# Altium schematic sheet OZ440-SE110-CAR001-SCH1.SchDoc: Carte IMU GPS
size A3; Date: 08/04/14; CheckedBy: GS; Author: BM; DocumentNumber: OZ440-SE110-CAR001-SCH01; Revision: A; SheetNumber: 1; SheetTotal: 1
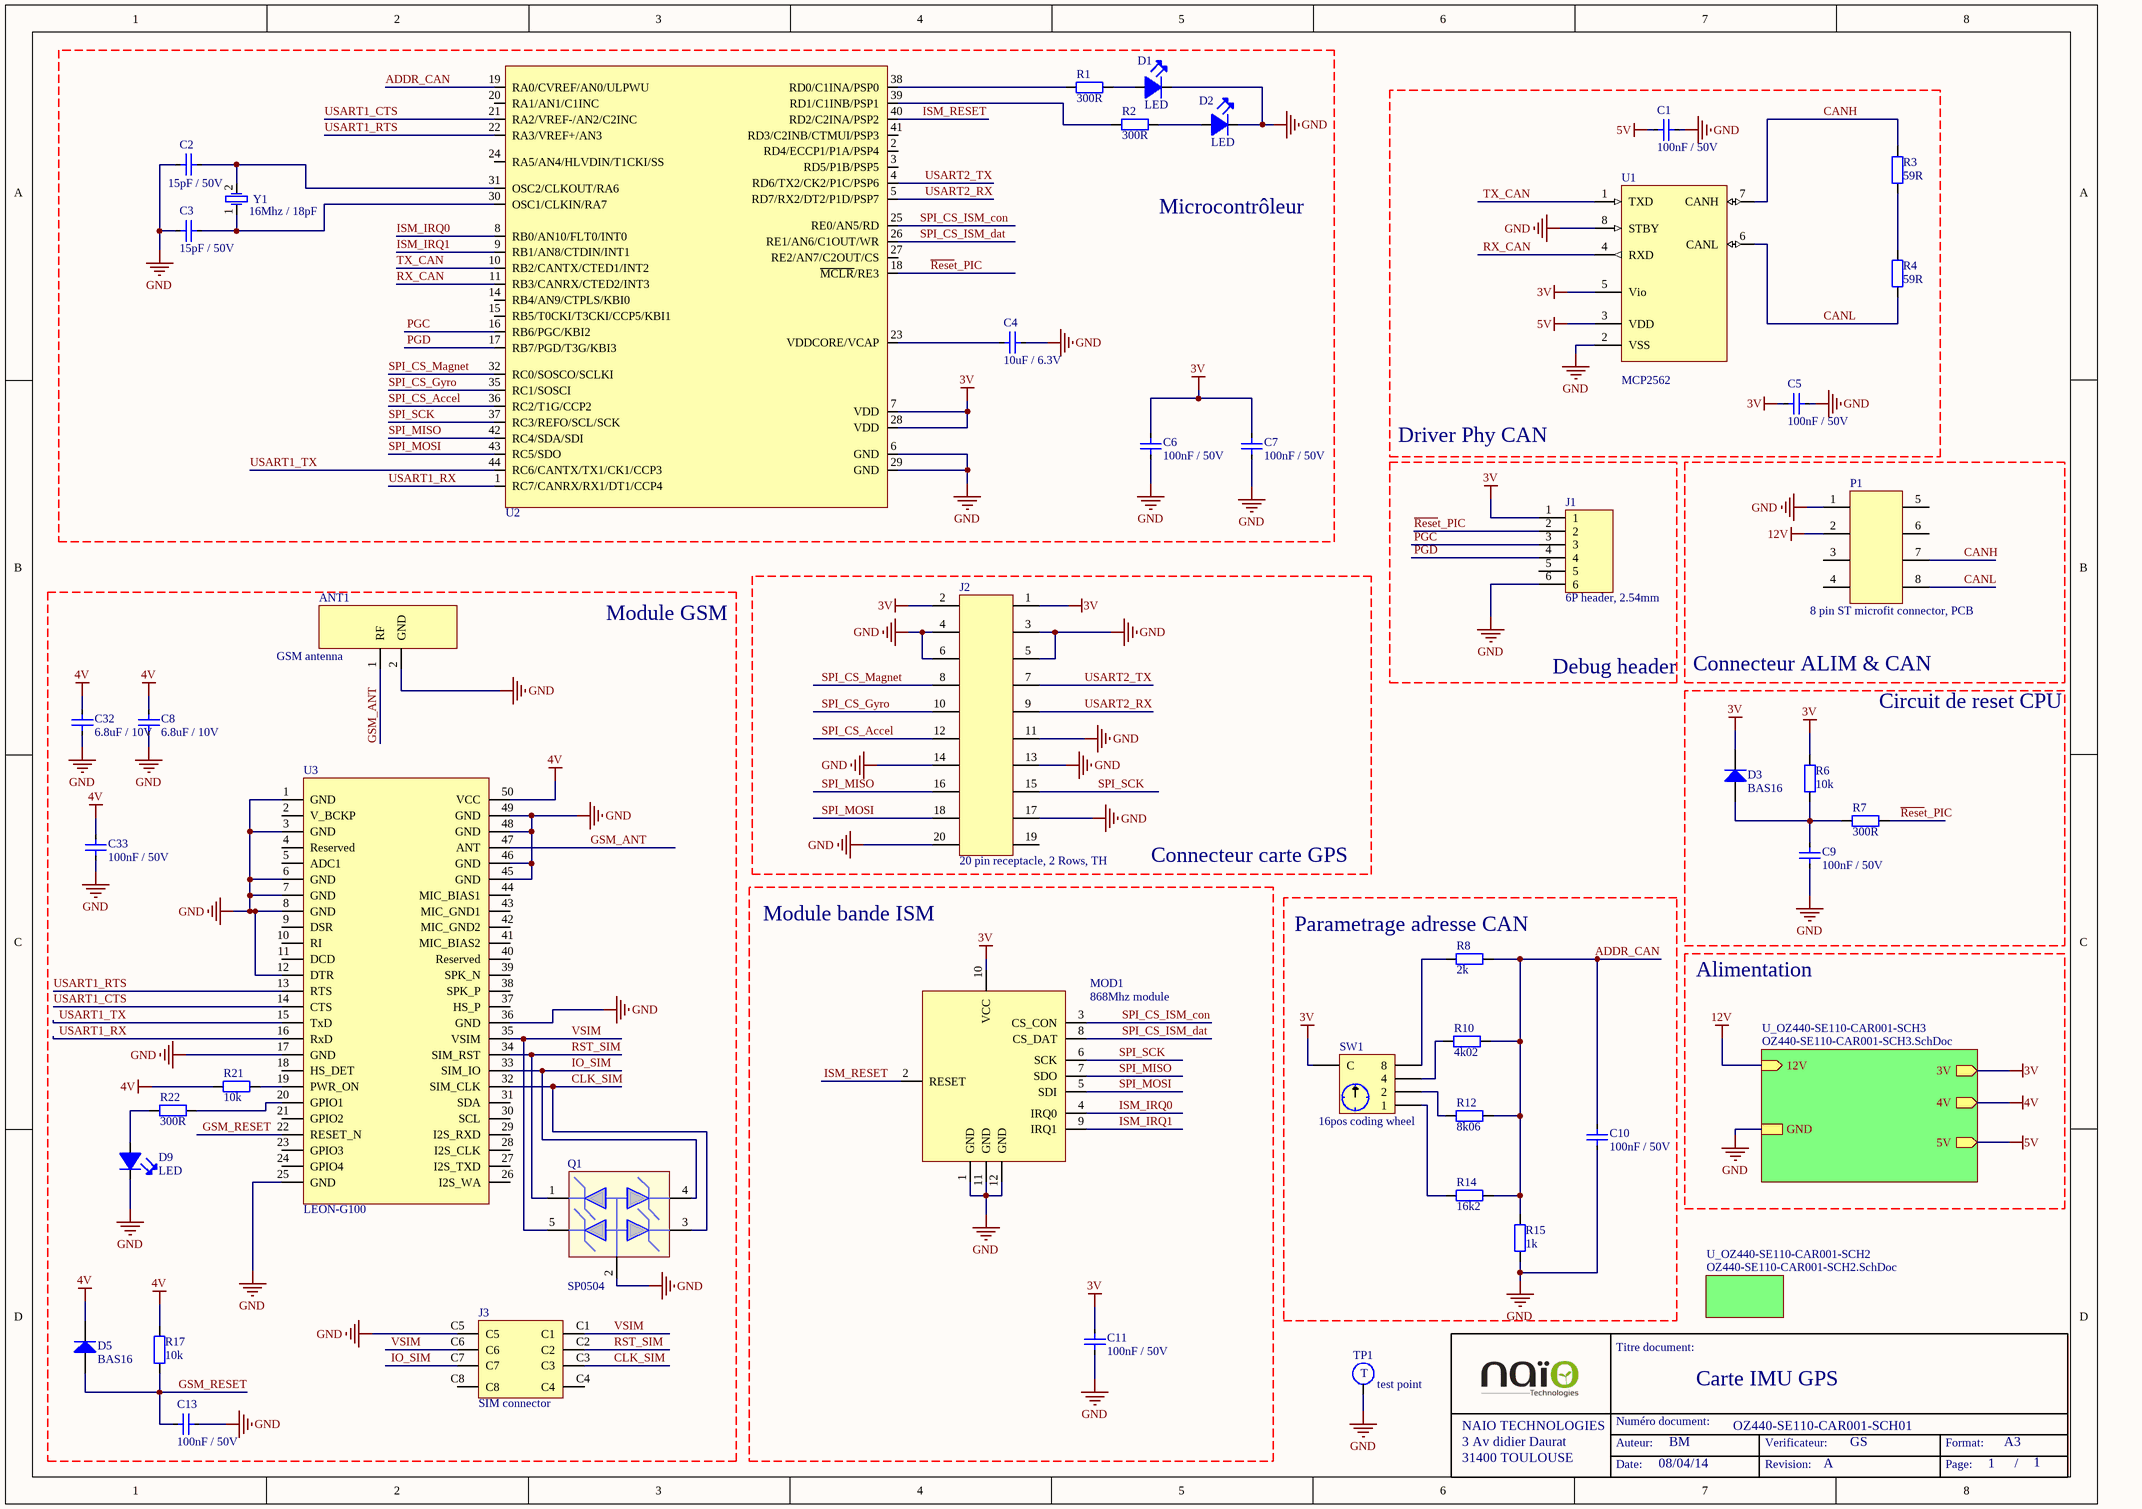
[diagram p0: OZ440-SE110-CAR001-SCH1.SchDoc]

## Parts
ANT1  Displayed reference: GSM antenna  [ANT_SMD-SPE-PA.22]  (hidden comment: ANT-STD-GSM)
C1  Displayed reference: 100nF / 50V  [C0805-STD]  (hidden comment: CAP-SMD)
C2  Displayed reference: 15pF / 50V  [C0805-STD]  (hidden comment: CAP-SMD)
C3  Displayed reference: 15pF / 50V  [C0805-STD]  (hidden comment: CAP-SMD)
C4  Displayed reference: 10uF / 6.3V  [C0805-STD]  (hidden comment: CAP-SMD)
C5  Displayed reference: 100nF / 50V  [C0805-STD]  (hidden comment: CAP-SMD)
C6  Displayed reference: 100nF / 50V  [C0805-STD]  (hidden comment: CAP-SMD)
C7  Displayed reference: 100nF / 50V  [C0805-STD]  (hidden comment: CAP-SMD)
C8  Displayed reference: 6.8uF / 10V  [C0805-STD]  (hidden comment: CAP-SMD)
C9  Displayed reference: 100nF / 50V  [C0805-STD]  (hidden comment: CAP-SMD)
C10  Displayed reference: 100nF / 50V  [C0805-STD]  (hidden comment: CAP-SMD)
C11  Displayed reference: 100nF / 50V  [C0805-STD]  (hidden comment: CAP-SMD)
C13  Displayed reference: 100nF / 50V  [C0805-STD]  (hidden comment: CAP-SMD)
C32  Displayed reference: 6.8uF / 10V  [C0805-STD]  (hidden comment: CAP-SMD)
C33  Displayed reference: 100nF / 50V  [C0805-STD]  (hidden comment: CAP-SMD)
D1  LED  [0603-SPE-LED]
D2  LED  [0603-SPE-LED]
D3  Displayed reference: BAS16  [SOT23-STD]  (hidden comment: BAS16-SOT23)
D5  Displayed reference: BAS16  [SOT23-STD]  (hidden comment: BAS16-SOT23)
D9  LED  [0603-SPE-LED]
J1  Displayed reference: 6P header, 2.54mm  [6P_HEADER-STD_TH_1ROW]  (hidden comment: CONN-STD-6P_1ROW)
J2  Displayed reference: 20 pin receptacle, 2 Rows, TH  [CONN-SPE_ESQ-110-12-G-D]  (hidden comment: CONN-STD-20P_2ROW)
J3  Displayed reference: SIM connector  [CONN-SPE-91228-3001_SIM_MOLEX]  (hidden comment: CONN-SPE_91228-3001_carte_SIM)
MOD1  Displayed reference: 868Mhz module  [MOD-SPE-MRF89]  (hidden comment: MRF89X-SMD12)
P1  Displayed reference: 8 pin ST microfit connector, PCB  [CONN-SPE_MOLEX_43045-0812]  (hidden comment: CONN-SPE-8P_MOLEX_43045-0801)
Q1  Displayed reference: SP0504  [SC70-SPE-SP0504]  (hidden comment: SP0504-SC70)
R1  Displayed reference: 300R  [R0805-STD]  (hidden comment: RES-SMD)
R2  Displayed reference: 300R  [R0805-STD]  (hidden comment: RES-SMD)
R3  Displayed reference: 59R  [R0805-STD]  (hidden comment: RES-SMD)
R4  Displayed reference: 59R  [R0805-STD]  (hidden comment: RES-SMD)
R6  Displayed reference: 10k  [R0805-STD]  (hidden comment: RES-SMD)
R7  Displayed reference: 300R  [R0805-STD]  (hidden comment: RES-SMD)
R8  Displayed reference: 2k  [R0805-STD]  (hidden comment: RES-SMD)
R10  Displayed reference: 4k02  [R0805-STD]  (hidden comment: RES-SMD)
R12  Displayed reference: 8k06  [R0805-STD]  (hidden comment: RES-SMD)
R14  Displayed reference: 16k2  [R0805-STD]  (hidden comment: RES-SMD)
R15  Displayed reference: 1k  [R0805-STD]  (hidden comment: RES-SMD)
R17  Displayed reference: 10k  [R0805-STD]  (hidden comment: RES-SMD)
R21  Displayed reference: 10k  [R0805-STD]  (hidden comment: RES-SMD)
R22  Displayed reference: 300R  [R0805-STD]  (hidden comment: RES-SMD)
SW1  Displayed reference: 16pos coding wheel  [SW-SPE-CTS_220-AMA16]  (hidden comment: Switch-STD-coding_wheel)
TP1  Displayed reference: test point  [MEC-STD-TEST_POINT_DIAM1.4]  (hidden comment: TP-STD-TEST_POINT)
U1  Displayed reference: MCP2562  [SO8-SPE-MCP2561]  (hidden comment: MCP2562-SOIC08)
U2  P18F45K80-TQFP44  [TQFP44-SPE-PIC18F45k80]  (value not drawn)
U3  Displayed reference: LEON-G100  [SMD50_SPE_LEON-Gx]  (hidden comment: LEON-Gx-SPE-SMD)
Y1  Displayed reference: 16Mhz / 18pF  [XTAL-SPE-HC49_SMD]  (hidden comment: XTAL-SMD)

## Sub-sheets
U_OZ440-SE110-CAR001-SCH2 = OZ440-SE110-CAR001-SCH2.SchDoc: no entries
U_OZ440-SE110-CAR001-SCH3 = OZ440-SE110-CAR001-SCH3.SchDoc: 12V (in), 4V (out), 3V (out), 5V (out), GND

## Nets
3V: C5.2 C6.2 C7.2 C11.2 D3.3(K) J1.1 J2.1 J2.2 MOD1.10(VCC) R6.2 SW1.C U1.5(Vio) U2.7(VDD) U2.28(VDD) ; sheet U_OZ440-SE110-CAR001-SCH3/3V
4V: C8.2 C32.2 C33.1 D5.3(K) R17.2 R21.2 U3.50(VCC) ; sheet U_OZ440-SE110-CAR001-SCH3/4V
5V: C1.2 U1.3(VDD) ; sheet U_OZ440-SE110-CAR001-SCH3/5V
12V: P1.2 ; sheet U_OZ440-SE110-CAR001-SCH3/12V
GND: ANT1.2(GND) C1.1 C2.1 C3.1 C4.2 C5.1 C6.1 C7.1 C8.1 C9.1 C10.1 C11.1 C13.1 C32.1 C33.2 D1.2 D2.2 D9.2 J1.6 J2.3 J2.4 J2.5 J2.6 J2.11 J2.13 J2.14 J2.17 J2.20 J3.C5 MOD1.1(GND) MOD1.11(GND) MOD1.12(GND) P1.1 Q1.2 R15.1 TP1.1(T) U1.2(VSS) U1.8(STBY) U2.6(GND) U2.29(GND) U3.1(GND) U3.3(GND) U3.6(GND) U3.7(GND) U3.8(GND) U3.12(DTR) U3.17(GND) U3.25(GND) U3.36(GND) U3.45(GND) U3.46(GND) U3.48(GND) U3.49(GND) ; sheet U_OZ440-SE110-CAR001-SCH3/GND
~{Rese}t_PIC: J1.2 R7.2 U2.18(~{MCLR}/RE3)
ADDR_CAN: C10.2 R8.2 R10.2 R12.2 R14.2 R15.2 U2.19(RA0/CVREF/AN0/ULPWU)
CANH: P1.7 R3.2 U1.7(CANH)
CANL: P1.8 R4.1 U1.6(CANL)
CLK_SIM: J3.C3 Q1.3 U3.32(SIM_CLK)
GSM_ANT: ANT1.1(RF) U3.47(ANT)
GSM_RESET: C13.2 D5.1(A) R17.1 U3.22(RESET_N)
IO_SIM: J3.C7 Q1.4 U3.33(SIM_IO)
ISM_IRQ0: MOD1.4(IRQ0) U2.8(RB0/AN10/FLT0/INT0)
ISM_IRQ1: MOD1.9(IRQ1) U2.9(RB1/AN8/CTDIN/INT1)
ISM_RESET: MOD1.2(RESET) U2.40(RD2/C2INA/PSP2)
PGC: J1.3 U2.16(RB6/PGC/KBI2)
PGD: J1.4 U2.17(RB7/PGD/T3G/KBI3)
RST_SIM: J3.C2 Q1.1 U3.34(SIM_RST)
RX_CAN: U1.4(RXD) U2.11(RB3/CANRX/CTED2/INT3)
SPI_CS_Accel: J2.12 U2.36(RC2/T1G/CCP2)
SPI_CS_Gyro: J2.10 U2.35(RC1/SOSCI)
SPI_CS_ISM_con: MOD1.3(CS_CON) U2.25(RE0/AN5/RD)
SPI_CS_ISM_dat: MOD1.8(CS_DAT) U2.26(RE1/AN6/C1OUT/WR)
SPI_CS_Magnet: J2.8 U2.32(RC0/SOSCO/SCLKI)
SPI_MISO: J2.16 MOD1.7(SDO) U2.42(RC4/SDA/SDI)
SPI_MOSI: J2.18 MOD1.5(SDI) U2.43(RC5/SDO)
SPI_SCK: J2.15 MOD1.6(SCK) U2.37(RC3/REFO/SCL/SCK)
TX_CAN: U1.1(TXD) U2.10(RB2/CANTX/CTED1/INT2)
USART1_CTS: U2.21(RA2/VREF-/AN2/C2INC) U3.14(CTS)
USART1_RTS: U2.22(RA3/VREF+/AN3) U3.13(RTS)
USART1_RX: U2.1(RC7/CANRX/RX1/DT1/CCP4) U3.16(RxD)
USART1_TX: U2.44(RC6/CANTX/TX1/CK1/CCP3) U3.15(TxD)
USART2_RX: J2.9 U2.5(RD7/RX2/DT2/P1D/PSP7)
USART2_TX: J2.7 U2.4(RD6/TX2/CK2/P1C/PSP6)
VSIM: J3.C1 J3.C6 Q1.5 U3.35(VSIM)
NetC2_2: C2.2 U2.31(OSC2/CLKOUT/RA6) Y1.2(OSC2)
NetC3_2: C3.2 U2.30(OSC1/CLKIN/RA7) Y1.1(OSC1)
NetC4_1: C4.1 U2.23(VDDCORE/VCAP)
NetC9_2: C9.2 D3.1(A) R6.1 R7.1
NetD1_1: D1.1(A) R1.2
NetD2_1: D2.1(A) R2.2
NetD9_1: D9.1(A) R22.1
NetR1_1: R1.1 U2.38(RD0/C1INA/PSP0)
NetR2_1: R2.1 U2.39(RD1/C1INB/PSP1)
NetR3_1: R3.1 R4.2
NetR8_1: R8.1 SW1.8
NetR10_1: R10.1 SW1.4
NetR12_1: R12.1 SW1.2
NetR14_1: R14.1 SW1.1
NetR21_1: R21.1 U3.19(PWR_ON)
NetR22_2: R22.2 U3.20(GPIO1)

Not connected (* = marked no-connect by the designer): J1 5; J2 19; J3 C4 C8; P1 3 4(7) 5(9) 6; U2 2(RD4/ECCP1/P1A/PSP4) 3(RD5/P1B/PSP5) 14(RB4/AN9/CTPLS/KBI0) 15(RB5/T0CKI/T3CKI/CCP5/KBI1) 20(RA1/AN1/C1INC) 24(RA5/AN4/HLVDIN/T1CKI/SS) 27(RE2/AN7/C2OUT/CS) 41(RD3/C2INB/CTMUI/PSP3); U3 2(V_BCKP) 4(Reserved) 5(ADC1) 9(DSR) 10(RI) 11(DCD) 18(HS_DET) 21(GPIO2) 23(GPIO3) 24(GPIO4) 26(I2S_WA) 27(I2S_TXD) 28(I2S_CLK) 29(I2S_RXD) 30(SCL) 31(SDA) 37(HS_P) 38(SPK_P) 39(SPK_N) 40(Reserved) 41(MIC_BIAS2) 42(MIC_GND2) 43(MIC_GND1) 44(MIC_BIAS1)

## Notes on the sheet
- Microcontrôleur
- Driver Phy CAN
- Module GSM
- Debug header
- Connecteur ALIM & CAN
- Circuit de reset CPU
- Module bande ISM
- Connecteur carte GPS
- (near R8) Parametrage adresse CAN
- Alimentation
- Titre document:
- NAIO TECHNOLOGIES
- 3 Av didier Daurat
- 31400 TOULOUSE
- Auteur:
- Numéro document:
- Verificateur:
- Format:
- A3
- Date:
- Revision:
- Page:
- /

## Library data of the parts
ANT1 = PA.22: GSM triband antenna; Manufacturer: TAOGLASS; reference: PA.22; Gain: 0; Validated: False; Pin Count: 2; Rev: F; helpURL: http://www.taoglas.com/images/product_images/original_images/PA.22A%20GSM%20PIFA%20Antenna%20280509.pdf; Supplier 1: Mouser; Supplier Part Number 1: 960-PA22A; Supplier 2: Digi-Key; Supplier Part Number 2: 931-1116-1-ND
C1 C5-C7 C9-C11 C13 C33 = VJ0805Y104KXAxx: 0805 100nF / 50V  X7R ceramic capacitor; Manufacturer: vishay; Max Voltage: 50; Tolerance: +/- 10%; Validated: N; Reference: VJ0805Y104KXAxx; Value: 100nF; Material: X7R; Footprint description: standard Capacitor 0805; Pin Count: 2; helpURL: http://www.vishay.com/docs/45200/highrels.pdf; Supplier 1: Farnell; Supplier Part Number 1: 1612208; Supplier 2: Digi-Key; Supplier Part Number 2: 720-1266-6-ND
C2 C3 = C0805C150J5GACxx: 0805 15pF / 50V COG ceramic capacitor; Manufacturer: Kemet; Max Voltage: 50; Tolerance: +/- 5%; Validated: N; Reference: C0805C150J5GACxx; Value: 15pF; Material: COG; Footprint description: standard Capacitor 0805; Pin Count: 2; helpURL: http://www.farnell.com/datasheets/40863.pdf; Supplier 1: Farnell; Supplier Part Number 1: 1650868; Supplier 2: Digi-Key; Supplier Part Number 2: 399-1111-1-ND
C4 = C0805C106K9PACxx: 0805 10uF / 6.3V X5R ceramic capacitor; Manufacturer: Kemet; Max Voltage: 6.3; Tolerance: +/- 10%; Validated: N; Reference: C0805C106K9PACxx; Value: 10uF; Material: X5R; Footprint description: standard Capacitor 0805; Pin Count: 2; helpURL: http://www.farnell.com/datasheets/40863.pdf; Supplier 1: Farnell; Supplier Part Number 1: 1643357; Supplier 2: Digi-Key; Supplier Part Number 2: 399-3138-1-ND
C8 C32 = C0805C685K8PACxx: 0805 6.8uF / 10V X5R ceramic capacitor; Manufacturer: Kemet; Max Voltage: 10; Tolerance: +/- 10%; Validated: N; Reference: C0805C685K8PACxx; Value: 6.8uF; Material: X5R; Footprint description: standard Capacitor 0805; Pin Count: 2; helpURL: http://www.farnell.com/datasheets/40863.pdf; Supplier 1: Farnell; Supplier Part Number 1: 1572632; Supplier 2: Mouser; Supplier Part Number 2: 80-C0805C685K8P
D1 D2 D9 = KP-1608SGC: SMD Green LED 0603; Manufacturer: KingBright; Max Current: 20mA; Reference: KP-1608SGC; Displayed reference: LED; Footprint description: 0603; Pin Count: 2; helpURL: http://www.farnell.com/datasheets/55768.pdf; Supplier 1: Farnell; Supplier Part Number 1: 8529833; Supplier 2: Newark; Supplier Part Number 2: 38K3374
D3 D5 = BAS16: 100V / 120mA signal  diode; Manufacturer: NXP; Max Voltage: 100; Max Current: 0.2A; Validated: False; Reference: BAS16; component type: DIODE; Footprint description: Sot23 SMD package; Pin Count: 3; Rev: 2010; helpURL: http://www.nxp.com/documents/data_sheet/BAS16_SER.pdf; Supplier 1: Farnell; Supplier Part Number 1: 1081180; Supplier 2: Digi-Key; Supplier Part Number 2: 568-1596-1-ND
J1 = 68000-406HLF: 6P, 1 row, 2.54mm header; Manufacturer: FCI; Validated: False; Reference: 68000-406HLF; Footprint description: TH, 6 pin, 2.54mm; Pin Count: 6; Rev: DB; helpURL: http://portal.fciconnect.com/Comergent//fci/drawing/68000.pdf
J2 = ESQ-110-12-G-D: 20 pin receptacle, 2.54mm, TH; Manufacturer: SAMTEC; Validated: False; Reference: ESQ-110-12-G-D; Footprint description: 20 pin receptacle, TH; Pin Count: 20; helpURL: https://www.samtec.com/technical-specifications/Default.aspx?SeriesMaster=ESQ; Supplier 1: Farnell; Supplier Part Number 1: 1769167
J3 = 91228-3001: 6 PIN SIM connector; Manufacturer: MOLEX; Validated: False; Reference: 91228-3001; Pin Count: 8; Rev: E; helpURL: http://www.molex.com/pdm_docs/sd/912283001_sd.pdf
MOD1 = MRF89XAM8A-I/RM: ISM band integrated module; Manufacturer: Microchip; Max Voltage: 3.6; Rated Power: 13 dBm; Frequency band: 868Mhz; Validated: False; Reference: MRF89XAM8A-I/RM; Footprint description: SMD package; Pin Count: 12; Rev: A; helpURL: http://ww1.microchip.com/downloads/en/DeviceDoc/70651A.pdf
P1 = 43045-0812: 8 pin Microfit connector; Manufacturer: Molex; Max Voltage: 600V; Max Current: 5A; Reference: 43045-0812; Footprint description: 8 pin SMT connector ST, TH; Rev: G; helpURL: http://www.molex.com/pdm_docs/sd/430450812_sd.pdf
Q1 = SP0504BAJTG: Diode TVS Aval 4ch.; Manufacturer: LITTLEFUSE; Max Voltage: 5V; Rated Power: 0.225W; Validated: False; Reference: SP0504BAJTG; component type: DIODE; Footprint description: SC70; Pin Count: 5; Rev: 11/04/2011; helpURL: http://www.littelfuse.com/data/en/Data_Sheets/Littefuse_SPA_SP050x.pdf; Supplier 1: Farnell; Supplier Part Number 1: 1827634; Supplier 2: Mouser; Supplier Part Number 2: 576-SP0504BAHTG
R1 R2 R7 R22 = CRCW0805300RFKxx: 300 ohm 0805 SMD resistor; Manufacturer: Vishay; Value: 300; Tolerance: 1%; Rated Power: 0.125W; Validated: No; Reference: CRCW0805300RFKxx; Footprint description: standard 0805 SMD; Pin Count: 2; helpURL: http://www.vishay.com/docs/20035/dcrcwe3.pdf; Supplier 1: Mouser; Supplier Part Number 1: 71-CRCW0805300RFKEA; Supplier 2: Farnell; Supplier Part Number 2: 1152346
R3 R4 = CRCW080559R0FKxx: 59 Ohm 0805 SMD resistor; Manufacturer: Vishay; Value: 59; Tolerance: 1 %; Rated Power: 0.125 W; Validated: No; Reference: CRCW080559R0FKxx; Footprint description: standard 0805 SMD; Pin Count: 2; helpURL: http://www.vishay.com/docs/20035/dcrcwe3.pdf; Supplier 1: Mouser; Supplier Part Number 1: 71-CRCW080559R0FKEA; Supplier 2: Farnell; Supplier Part Number 2: 2138817
R6 R17 R21 = CRCW080510K0FKxx: 10k Ohm 0805 SMD resistor; Manufacturer: Vishay; Value: 10 000; Tolerance: 1 %; Rated Power: 0,125 W; Validated: No; Reference: CRCW080510K0FKxx; Footprint description: standard 0805 SMD; Pin Count: 2; helpURL: http://www.vishay.com/docs/20035/dcrcwe3.pdf; Supplier 1: Farnell; Supplier Part Number 1: 1469856; Supplier 2: Mouser; Supplier Part Number 2: 71-CRCW0805-10K-E3
R8 = CRCW08052K00FKxx: 2k Ohm 0805 SMD resistor; Manufacturer: Vishay; Value: 2 000; Tolerance: 1%; Rated Power: 0.125W; Validated: No; Reference: CRCW08052K00FKxx; Footprint description: standard 0805 SMD; Pin Count: 2; helpURL: http://www.vishay.com/docs/20035/dcrcwe3.pdf; Supplier 1: Mouser; Supplier Part Number 1: 71-CRCW08052K00FKEB; Supplier 2: Farnell; Supplier Part Number 2: 1469884
R10 = CRCW08054K02FKxx: 4k02 Ohm 0805 SMD resistor; Manufacturer: Vishay; Value: 4 020; Tolerance: 1%; Rated Power: 0.125W; Validated: No; Reference: CRCW08054K02FKxx; Footprint description: standard 0805 SMD; Pin Count: 2; helpURL: http://www.vishay.com/docs/20035/dcrcwe3.pdf; Supplier 1: Farnell; Supplier Part Number 1: 1469920; Supplier 2: Mouser; Supplier Part Number 2: 71-CRCW0805-4.02K-E3
R12 = CRCW08058K06FKxx: 8k06 Ohm 0805 SMD resistor; Manufacturer: Vishay; Value: 8 060; Tolerance: 1%; Rated Power: 0.125W; Validated: No; Reference: CRCW08058K06FKxx; Footprint description: standard 0805 SMD; Pin Count: 2; helpURL: http://www.vishay.com/docs/20035/dcrcwe3.pdf; Supplier 1: Farnell; Supplier Part Number 1: 1653038; Supplier 2: Mouser; Supplier Part Number 2: 71-CRCW0805-8.06K-E3
R14 = CRCW080516K2FKxx: 16k2 Ohm 0805 SMD resistor; Manufacturer: Vishay; Value: 16200; Tolerance: 1%; Rated Power: 0.125W; Validated: No; Reference: CRCW080516K2FKxx; Footprint description: standard 0805 SMD; Pin Count: 2; helpURL: http://www.vishay.com/docs/20035/dcrcwe3.pdf; Supplier 1: Mouser; Supplier Part Number 1: 71-CRCW0805-16.2K-E3; Supplier 2: Farnell; Supplier Part Number 2: 1469878
R15 = CRCW08051K00FKxx: 1k Ohm 0805 SMD resistor; Manufacturer: Vishay; Value: 1 000; Tolerance: 1 %; Rated Power: 0,125 W; Validated: No; Reference: CRCW08051K00FKxx; Footprint description: standard 0805 SMD; Pin Count: 2; helpURL: http://www.vishay.com/docs/20035/dcrcwe3.pdf; Supplier 1: Farnell; Supplier Part Number 1: 1469847; Supplier 2: Mouser; Supplier Part Number 2: 71-CRCW0805-1.0K-E3
SW1 = 220AMA16x: 16 positions rotary dip switch; Manufacturer: CTS; Validated: False; Reference: 220AMA16x; Footprint description: 10x10mm SMD; Pin Count: 6; Rev: 20/02/14; helpURL: http://www.ctscorp.com/components/Datasheets/220.pdf; Supplier 1: Mouser; Supplier Part Number 1: 774-220AMA16R; Supplier 2: Digi-Key; Supplier Part Number 2: CT3072-6-ND
TP1 = 3110053000500: Fork test point, diam 1,4mm, gold plated; Manufacturer: Kontek; Validated: False; Reference: 3110053000500; helpURL: http://www.stelvio-kontek.com/vedit/15/front_prodotto.asp?id=256&pagina=1312&macroarea=3&area=9; Supplier 1: radiospares; Supplier Part Number 1: 245-4061
U1 = MCP2562-E/SN: CAN transceiver with Vio pin; Manufacturer: Microchip; Max Voltage: 5.5V; Validated: False; Reference: MCP2562-E/SN; Footprint description: standard SO8; Pin Count: 8; Rev: B; helpURL: http://ww1.microchip.com/downloads/en/DeviceDoc/25167B.pdf; Supplier 1: Farnell; Supplier Part Number 1: 2362839; Supplier 2: Mouser; Supplier Part Number 2: 579-MCP2562-E/SN
U2 = PIC18F45K80-I/PT: Pic microcontroller with embeded CAN controller; Manufacturer: MICROCHIP; Validated: False; Reference: PIC18F45K80-I/PT; Displayed reference: PIC18F45K80-I/PT; Footprint description: standard TQFP 44 pin; Pin Count: 44; Rev: F; helpURL: http://ww1.microchip.com/downloads/en/DeviceDoc/39977f.pdf; Supplier 1: Farnell; Supplier Part Number 1: 1823169; Supplier 2: Mouser; Supplier Part Number 2: 579-PIC18F45K80-I/PT
U3 = LEON-G100: Quad band GSM module; Manufacturer: Ublox; Max Voltage: 4.5; Max Current: 2A; Validated: False; Reference: LEON-G100; Footprint description: 50 PIN LCC package; Pin Count: 50; Rev: 08; helpURL: http://www.u-blox.com/images/downloads/Product_Docs/LEON-G1-G2_DataSheet_(UBX-13001913).pdf
Y1 = MCRSD16000F183000RR: 16Mhz Crystal; Manufacturer: Multicomp; Value: 16 000; Validated: False; Reference: MCRSD16000F183000RR; Footprint description: HC49 /US SMD; Pin Count: 2; Frequency band: 16Mhz; Rev: 1.0; helpURL: http://www.farnell.com/datasheets/1801275.pdf; Supplier 1: Farnell; Supplier Part Number 1: 2395958